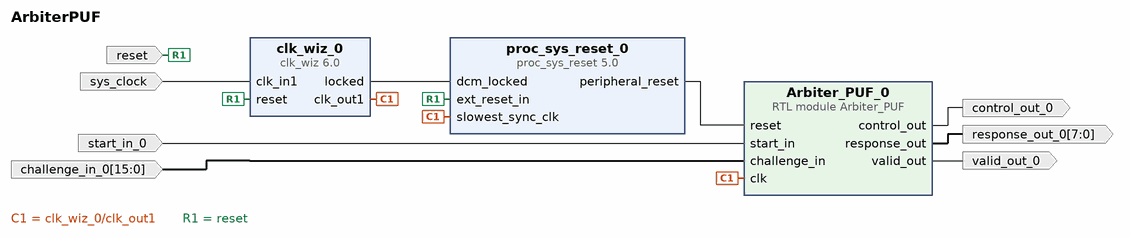
[diagram p0: block diagram of the top level]
# Vivado block design ArbiterPUF, xc7a35tcpg236-1, Vivado 2020.2
create_bd_design ArbiterPUF

create_bd_port -dir I -type clk sys_clock
set_property -dict {CONFIG.FREQ_HZ 100000000 CONFIG.PHASE 0.000} [get_bd_ports sys_clock]
create_bd_port -dir I -type rst reset
set_property -dict {CONFIG.POLARITY ACTIVE_HIGH} [get_bd_ports reset]
create_bd_port -dir I start_in_0
create_bd_port -dir I -from 15 -to 0 challenge_in_0
create_bd_port -dir O -from 7 -to 0 response_out_0
create_bd_port -dir O control_out_0
create_bd_port -dir O valid_out_0

create_bd_cell -type ip -vlnv xilinx.com:ip:clk_wiz:6.0 clk_wiz_0
set_property -dict [list \
  CONFIG.CLK_IN1_BOARD_INTERFACE sys_clock \
  CONFIG.RESET_BOARD_INTERFACE reset \
  CONFIG.USE_BOARD_FLOW true \
] [get_bd_cells clk_wiz_0]
create_bd_cell -type module -reference Arbiter_PUF Arbiter_PUF_0
create_bd_cell -type ip -vlnv xilinx.com:ip:proc_sys_reset:5.0 proc_sys_reset_0

# ---- connections ----

connect_bd_net [get_bd_ports sys_clock] [get_bd_pins clk_wiz_0/clk_in1]
connect_bd_net [get_bd_pins clk_wiz_0/clk_out1] [get_bd_pins Arbiter_PUF_0/clk] [get_bd_pins proc_sys_reset_0/slowest_sync_clk]
connect_bd_net [get_bd_ports reset] [get_bd_pins proc_sys_reset_0/ext_reset_in] [get_bd_pins clk_wiz_0/reset]
connect_bd_net [get_bd_pins clk_wiz_0/locked] [get_bd_pins proc_sys_reset_0/dcm_locked]
connect_bd_net [get_bd_pins proc_sys_reset_0/peripheral_reset] [get_bd_pins Arbiter_PUF_0/reset]
connect_bd_net -net start_in_0_1 [get_bd_ports start_in_0] [get_bd_pins Arbiter_PUF_0/start_in]
connect_bd_net -net challenge_in_0_1 [get_bd_ports challenge_in_0] [get_bd_pins Arbiter_PUF_0/challenge_in]
connect_bd_net [get_bd_pins Arbiter_PUF_0/response_out] [get_bd_ports response_out_0]
connect_bd_net [get_bd_pins Arbiter_PUF_0/control_out] [get_bd_ports control_out_0]
connect_bd_net [get_bd_pins Arbiter_PUF_0/valid_out] [get_bd_ports valid_out_0]

validate_bd_design
save_bd_design
